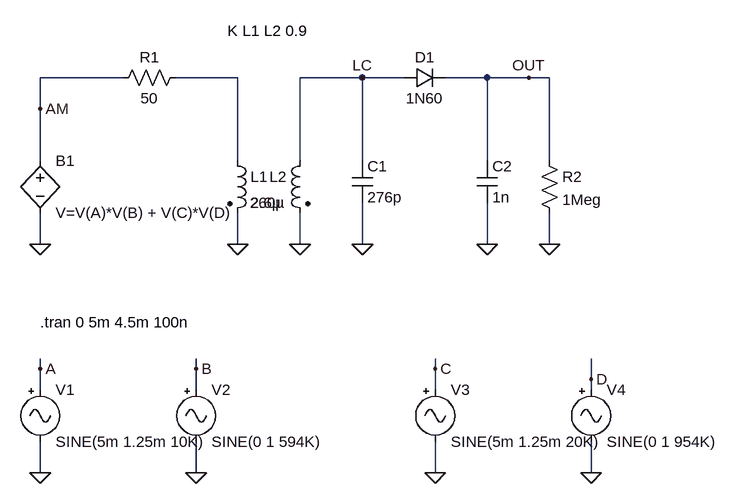
[diagram p0: schematic Draft1.asc]
Draft1.asc, the LTspice schematic file:
Version 4
SHEET 1 1252 848
WIRE 336 224 208 224
WIRE 512 224 416 224
WIRE 704 224 608 224
WIRE 768 224 704 224
WIRE 896 224 832 224
WIRE 960 224 896 224
WIRE 992 224 960 224
WIRE 208 272 208 224
WIRE 208 352 208 272
WIRE 512 352 512 224
WIRE 608 352 608 224
WIRE 704 352 704 224
WIRE 896 352 896 224
WIRE 992 352 992 224
WIRE 208 480 208 432
WIRE 512 480 512 432
WIRE 608 480 608 432
WIRE 704 480 704 416
WIRE 896 480 896 416
WIRE 992 480 992 432
WIRE 208 672 208 656
WIRE 448 672 448 656
WIRE 816 672 816 656
WIRE 1056 688 1056 656
WIRE 208 704 208 672
WIRE 448 704 448 672
WIRE 816 704 816 672
WIRE 1056 704 1056 688
WIRE 208 832 208 784
WIRE 448 832 448 784
WIRE 816 832 816 784
WIRE 1056 832 1056 784
FLAG 208 480 0
FLAG 512 480 0
FLAG 608 480 0
FLAG 704 480 0
FLAG 896 480 0
FLAG 992 480 0
FLAG 208 272 AM
FLAG 960 224 OUT
FLAG 704 224 LC
FLAG 208 832 0
FLAG 448 832 0
FLAG 816 832 0
FLAG 1056 832 0
FLAG 208 672 A
FLAG 448 672 B
FLAG 816 672 C
FLAG 1056 688 D
SYMBOL res 320 240 R270
WINDOW 0 32 56 VTop 2
WINDOW 3 0 56 VBottom 2
SYMATTR InstName R1
SYMATTR Value 50
SYMBOL res 976 336 R0
SYMATTR InstName R2
SYMATTR Value 1Meg
SYMBOL cap 688 352 R0
SYMATTR InstName C1
SYMATTR Value 276p
SYMBOL cap 880 352 R0
SYMATTR InstName C2
SYMATTR Value 1n
SYMBOL diode 768 240 R270
WINDOW 0 32 32 VTop 2
WINDOW 3 0 32 VBottom 2
SYMATTR InstName D1
SYMATTR Value 1N60
SYMBOL ind2 496 336 R0
SYMATTR InstName L1
SYMATTR Value 2.6µ
SYMBOL ind2 624 336 M0
WINDOW 3 93 80 Right 2
SYMATTR InstName L2
SYMATTR Value 260µ
SYMBOL Misc/signal 208 688 R0
SYMATTR InstName V1
SYMATTR Value SINE(5m 1.25m 10K)
SYMBOL Misc/signal 448 688 R0
SYMATTR InstName V2
SYMATTR Value SINE(0 1 594K)
SYMBOL Misc/signal 816 688 R0
SYMATTR InstName V3
SYMATTR Value SINE(5m 1.25m 20K)
SYMBOL Misc/signal 1056 688 R0
SYMATTR InstName V4
SYMATTR Value SINE(0 1 954K)
SYMBOL bv 208 336 R0
SYMATTR InstName B1
SYMATTR Value V=V(A)*V(B) + V(C)*V(D)
TEXT 496 152 Left 2 !K L1 L2 0.9
TEXT 208 600 Left 2 !.tran 0 5m 4.5m 100n

The netlist it stands for:
* Draft1.asc
R1 AM N001 50
R2 OUT 0 1Meg
C1 LC 0 276p
C2 OUT 0 1n
D1 LC OUT 1N60
L1 N001 0 2.6µ
L2 LC 0 260µ
V1 A 0 SINE(5m 1.25m 10K)
V2 B 0 SINE(0 1 594K)
V3 C 0 SINE(5m 1.25m 20K)
V4 D 0 SINE(0 1 954K)
B1 AM 0 V=V(A)*V(B) + V(C)*V(D)
.model D D
.lib standard.dio
K L1 L2 0.9
.tran 0 5m 4.5m 100n
.backanno
.end